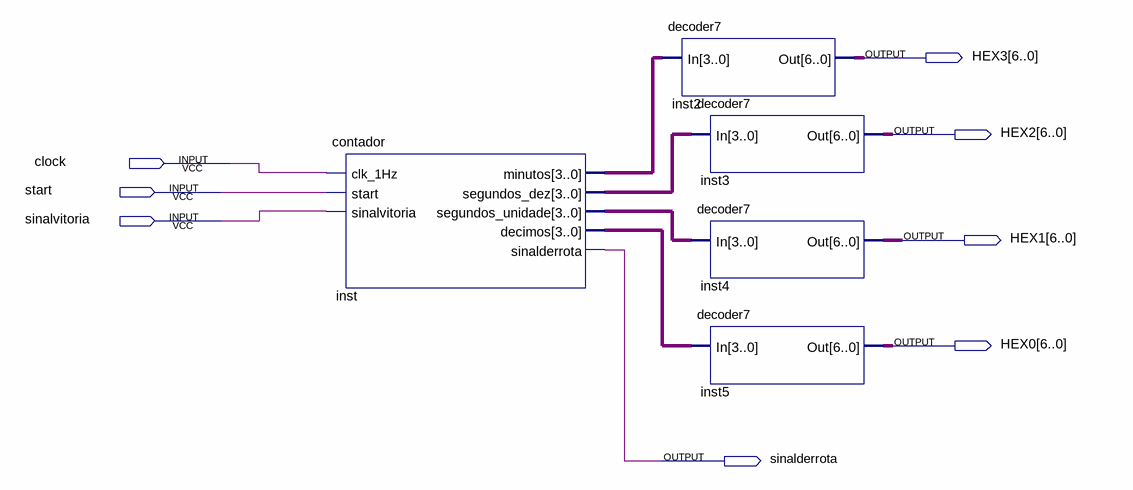
[diagram p0: schematic sheet]
// Quartus schematic esquematicotestes.bdf as structural Verilog: 5 symbols, 8 pins
module esquematicotestes (
  input  clock,
  input  start,
  input  sinalvitoria,
  output [6:0] HEX3,
  output [6:0] HEX2,
  output [6:0] HEX1,
  output [6:0] HEX0,
  output sinalderrota
);

  wire [3:0] inst_decimos, inst_minutos, inst_segundos_dez, inst_segundos_unidade;

  contador inst (
    .clk_1Hz(clock), .start(start), .sinalvitoria(sinalvitoria), .minutos(inst_minutos),
    .segundos_dez(inst_segundos_dez), .segundos_unidade(inst_segundos_unidade), .decimos(inst_decimos),
    .sinalderrota(sinalderrota));
  decoder7 inst2 (.In(inst_minutos), .Out(HEX3));
  decoder7 inst3 (.In(inst_segundos_dez), .Out(HEX2));
  decoder7 inst4 (.In(inst_segundos_unidade), .Out(HEX1));
  decoder7 inst5 (.In(inst_decimos), .Out(HEX0));
endmodule
